# Altium schematic sheet JLINK V8_V1.SchDoc
size A3
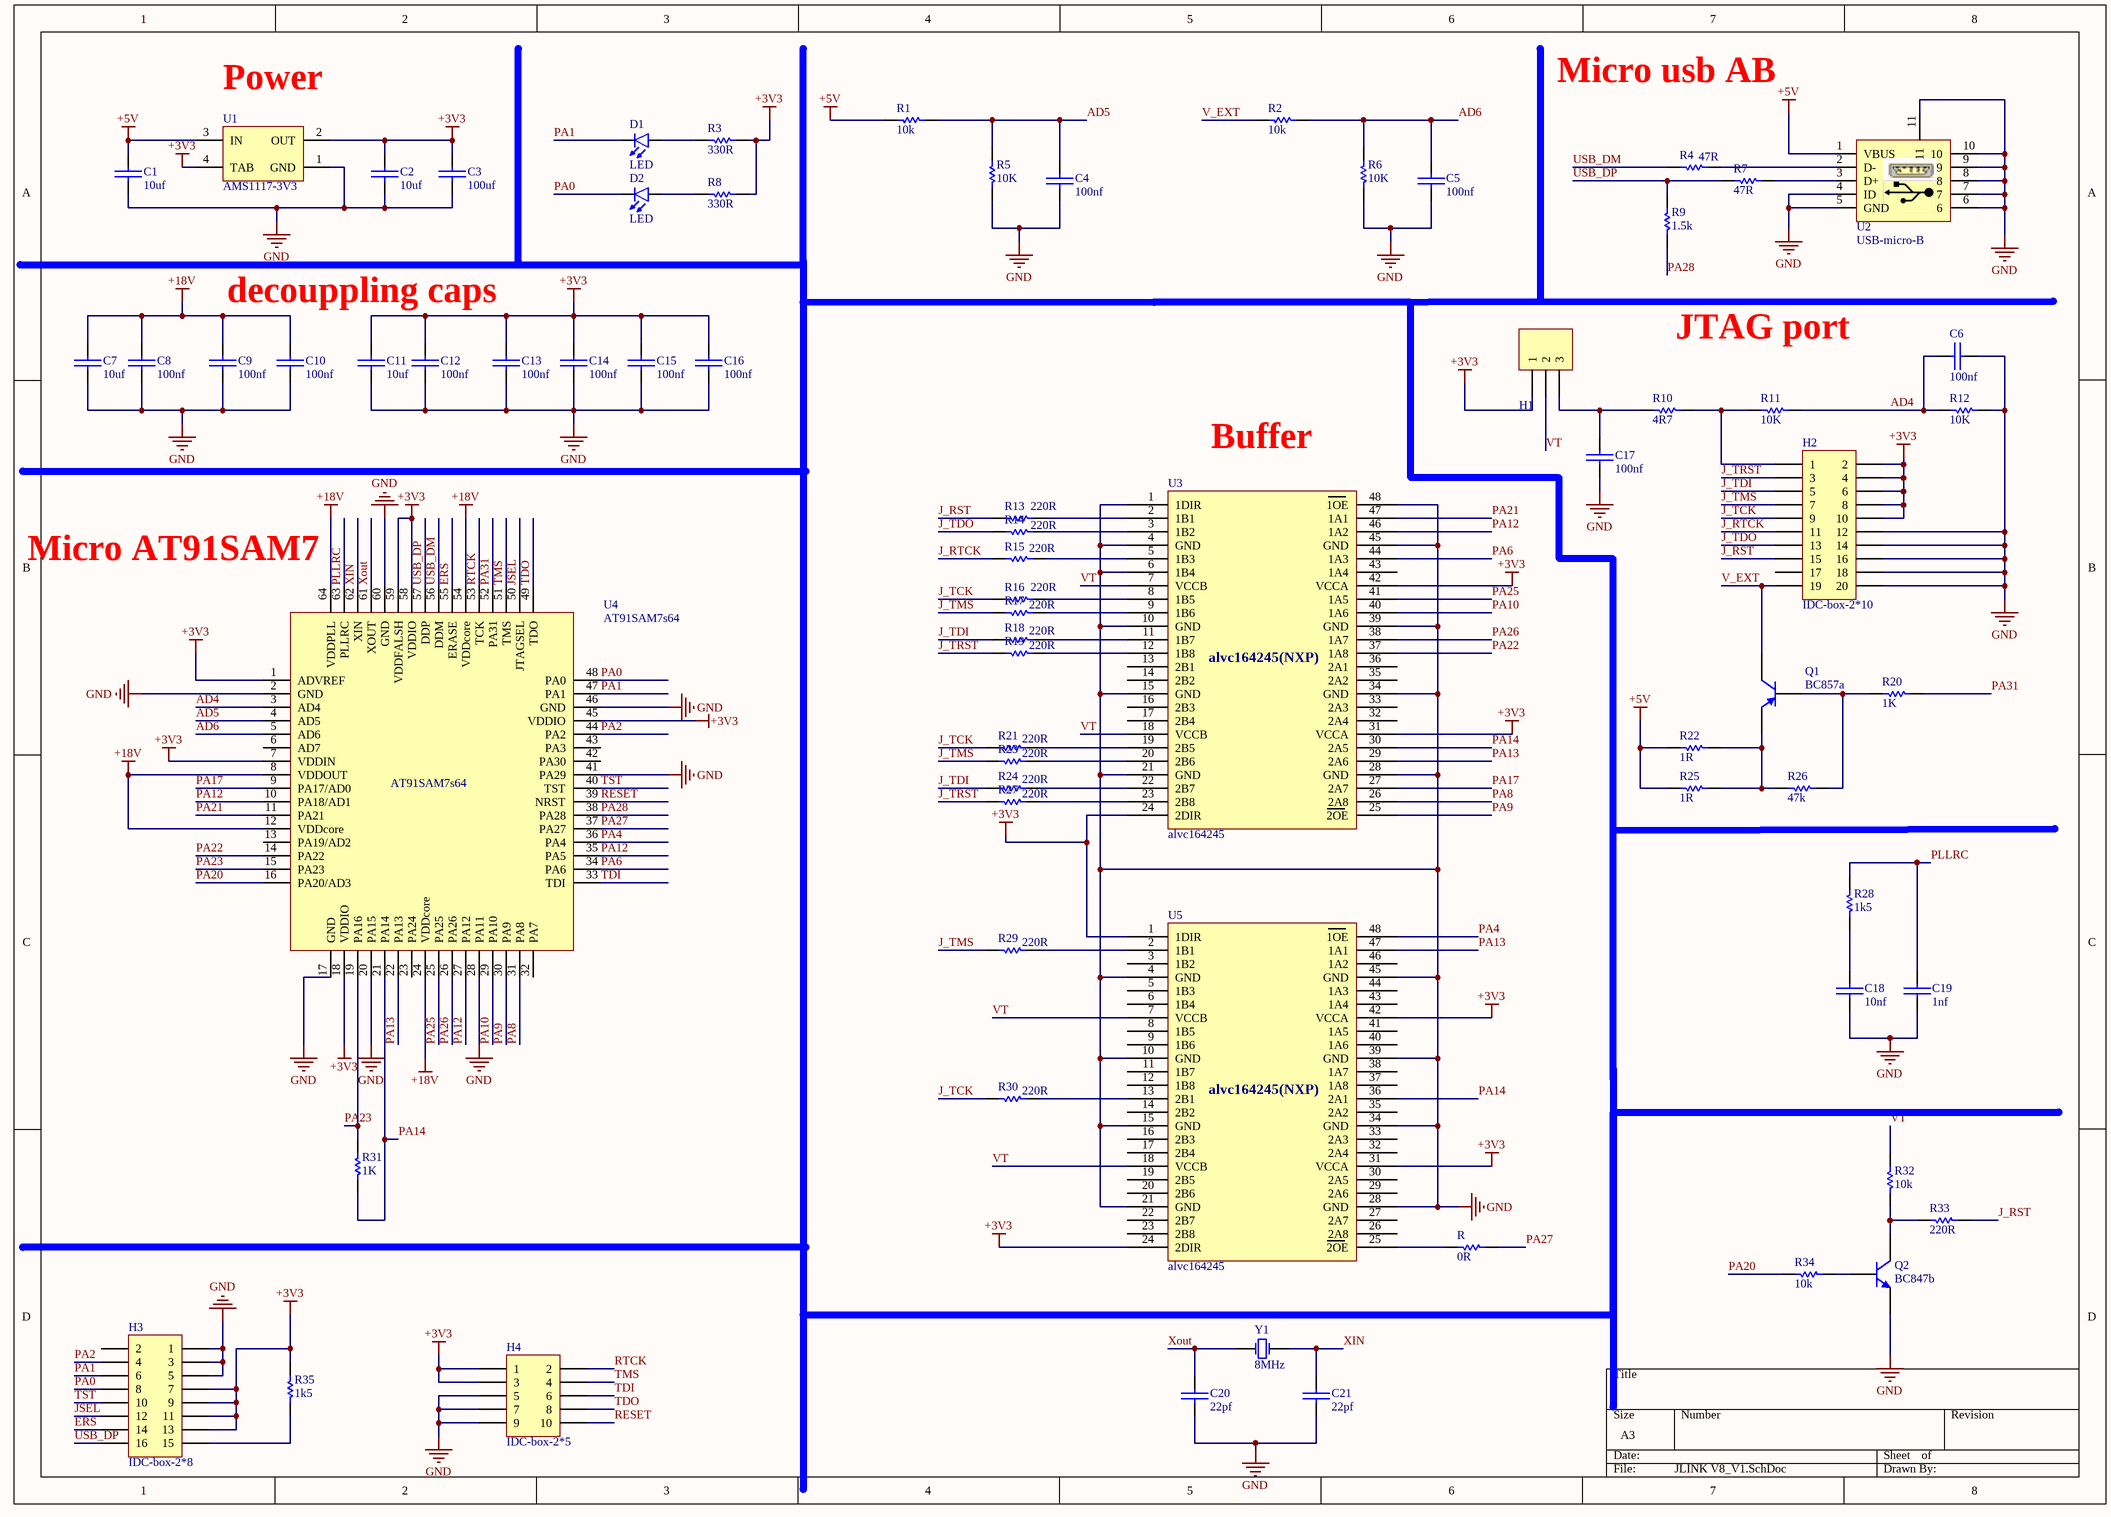
[diagram p0: JLINK V8_V1.SchDoc]

## Parts
C1  10uf  [CAP-0805 - better]
C2  10uf  [CAP-0805 - better]
C3  100uf  [CAP-0805 - better]
C4  100nf  [CAP-0805 - better]
C5  100nf  [CAP-0805 - better]
C6  100nf  [CAP-0805 - better]
C7  10uf  [CAP-0805 - better]
C8  100nf  [CAP-0805 - better]
C9  100nf  [CAP-0805 - better]
C10  100nf  [CAP-0805 - better]
C11  10uf  [CAP-0805 - better]
C12  100nf  [CAP-0805 - better]
C13  100nf  [CAP-0805 - better]
C14  100nf  [CAP-0805 - better]
C15  100nf  [CAP-0805 - better]
C16  100nf  [CAP-0805 - better]
C17  100nf  [CAP-0805 - better]
C18  10nf  [CAP-0805 - better]
C19  1nf  [CAP-0805 - better]
C20  22pf  [CAP-0805 - better]
C21  22pf  [CAP-0805 - better]
D1  LED  [LED-SMD-0805]
D2  LED  [LED-SMD-0805]
H1  Header 3  [PIN-header3(copy)]  (value not drawn)
H2  IDC-box-2*10  [ICD-box_10*2]
H3  IDC-box-2*8  [male-Header 2*8]
H4  IDC-box-2*5  [male-Header-2*5 - duplicate]
Q1  BC857a  [sot23]
Q2  BC847b  [sot23]
R  0R  [Res_SMD_0805]
R1  10k  [Res_SMD_0805]
R2  10k  [Res_SMD_0805]
R3  330R  [Res_SMD_0805]
R4  47R  [Res_SMD_0805]
R5  10K  [Res_SMD_0805]
R6  10K  [Res_SMD_0805]
R7  47R  [Res_SMD_0805]
R8  330R  [Res_SMD_0805]
R9  1.5k  [Res_SMD_0805]
R10  4R7  [Res_SMD_0805]
R11  10K  [Res_SMD_0805]
R12  10K  [Res_SMD_0805]
R13  220R  [Res_SMD_0805]
R14  220R  [Res_SMD_0805]
R15  220R  [Res_SMD_0805]
R16  220R  [Res_SMD_0805]
R17  220R  [Res_SMD_0805]
R18  220R  [Res_SMD_0805]
R19  220R  [Res_SMD_0805]
R20  1K  [Res_SMD_0805]
R21  220R  [Res_SMD_0805]
R22  1R  [Res_SMD_0805]
R23  220R  [Res_SMD_0805]
R24  220R  [Res_SMD_0805]
R25  1R  [Res_SMD_0805]
R26  47k  [Res_SMD_0805]
R27  220R  [Res_SMD_0805]
R28  1k5  [Res_SMD_0805]
R29  220R  [Res_SMD_0805]
R30  220R  [Res_SMD_0805]
R31  1K  [Res_SMD_0805]
R32  10k  [Res_SMD_0805]
R33  220R  [Res_SMD_0805]
R34  10k  [Res_SMD_0805]
R35  1k5  [Res_SMD_0805]
U1  AMS1117-3V3  [AMS1117-3V3]
U2  USB-micro-B  [USB-micro-b]
U3  alvc164245  [SSOP48]
U4  AT91SAM7s64  [LQFP-64]
U5  alvc164245  [SSOP48]
Y1  8MHz  [crystall]

## Nets
+3V3: C2.1(+) C3.1(+) C11.1(+) C12.1(+) C13.1(+) C14.1(+) C15.1(+) C16.1(+) H1.1 H2.2 H2.4 H2.6 H2.8 H2.10 H3.7 H3.9 H3.11 H3.13 H4.1 H4.3 R3.1 R8.1 R35.1 U1.2(OUT) U1.4(TAB) U3.24(2DIR) U3.31(VCCA) U3.42(VCCA) U4.1(ADVREF) U4.7(VDDIN) U4.18(VDDIO) U4.45(VDDIO) U4.58(VDDIO) U4.59(VDDFALSH) U5.1(1DIR) U5.24(2DIR) U5.31(VCCA) U5.42(VCCA)
+5V: C1.1(+) R1.2 R22.2 R25.2 U1.3(IN) U2.1(VBUS)
+18V: C7.1(+) C8.1(+) C9.1(+) C10.1(+) U4.8(VDDOUT) U4.12(VDDcore) U4.24(VDDcore) U4.54(VDDcore) U4.64(VDDPLL)
GND: C1.2(-) C2.2(-) C3.2(-) C4.2(-) C5.2(-) C6.2(-) C7.2(-) C8.2(-) C9.2(-) C10.2(-) C11.2(-) C12.2(-) C13.2(-) C14.2(-) C15.2(-) C16.2(-) C17.2(-) C18.2(-) C19.2(-) C20.2(-) C21.2(-) H2.12 H2.14 H2.16 H2.18 H2.20 H3.1 H3.3 H3.5 H4.5 H4.7 H4.9 Q2.2(E) R5.2 R6.2 R12.2 U1.1(GND) U2.4(ID) U2.5(GND) U2.6 U2.7 U2.8 U2.9 U2.10 U2.11 U3.1(1DIR) U3.4(GND) U3.6(1B4) U3.10(GND) U3.15(GND) U3.21(GND) U3.28(GND) U3.34(GND) U3.39(GND) U3.45(GND) U3.48(1OE) U4.2(GND) U4.17(GND) U4.20(PA15) U4.28(PA11) U4.41(PA29) U4.46(GND) U4.60(GND) U5.4(GND) U5.10(GND) U5.15(GND) U5.21(GND) U5.28(GND) U5.34(GND) U5.39(GND) U5.45(GND)
AD4: C6.1(+) R11.2 R12.1 U4.3(AD4)
AD5: C4.1(+) R1.1 R5.1 U4.4(AD5)
AD6: C5.1(+) R2.1 R6.1 U4.5(AD6)
ERS: H3.14 U4.55(ERASE)
J_RST: H2.15 R13.2 R33.1
J_RTCK: H2.11 R15.2
J_TCK: H2.9 R16.2 R21.2 R30.2
J_TDI: H2.5 R18.2 R24.2
J_TDO: H2.13 R14.2
J_TMS: H2.7 R17.2 R23.2 R29.2
J_TRST: H2.3 R19.2 R27.2
JSEL: H3.12 U4.50(JTAGSEL)
PA0: D2.2(K) H3.8 U4.48(PA0)
PA1: D1.2(K) H3.6 U4.47(PA1)
PA2: H3.4 U4.44(PA2)
PA4: U4.36(PA4) U5.48(1OE)
PA6: U3.44(1A3) U4.34(PA6)
PA8: U3.26(2A8) U4.31(PA8)
PA9: U3.25(2OE) U4.30(PA9)
PA10: U3.40(1A6) U4.29(PA10)
PA12: U3.46(1A2) U4.10(PA18/AD1) U4.27(PA12) U4.35(PA5)
PA13: U3.29(2A6) U4.22(PA13) U5.47(1A1)
PA14: R31.2 U3.30(2A5) U4.21(PA14) U5.36(2A1)
PA17: U3.27(2A7) U4.9(PA17/AD0)
PA20: R34.2 U4.16(PA20/AD3)
PA21: U3.47(1A1) U4.11(PA21)
PA22: U3.37(1A8) U4.14(PA22)
PA23: R31.1 U4.15(PA23) U4.19(PA16)
PA25: U3.41(1A5) U4.25(PA25)
PA26: U3.38(1A7) U4.26(PA26)
PA27: R.1 U4.37(PA27)
PA28: R9.2 U4.38(PA28)
PA31: R20.1 U4.52(PA31)
PLLRC: C19.1(+) R28.1 U4.63(PLLRC)
RESET: H4.10 U4.39(NRST)
RTCK: H4.2 U4.53(TCK)
TDI: H4.6 U4.33(TDI)
TDO: H4.8 U4.49(TDO)
TMS: H4.4 U4.51(TMS)
TST: H3.10 U4.40(TST)
USB_DM: R4.2 U4.56(DDM)
USB_DP: H3.16 R7.2 R9.1 U4.57(DDP)
V_EXT: H2.19 Q1.3(C) R2.2
VT: H1.2 R32.1 U3.7(VCCB) U3.18(VCCB) U5.7(VCCB) U5.18(VCCB)
XIN: C21.1(+) U4.62(XIN) Y1.1(OSC1)
Xout: C20.1(+) U4.61(XOUT) Y1.2(OSC2)
NetC17_1: C17.1(+) H1.3 R10.2
NetC18_1: C18.1(+) R28.2
NetD1_1: D1.1(A) R3.2
NetD2_1: D2.1(A) R8.2
NetH2_1: H2.1 R10.1 R11.1
NetH3_15: H3.15 R35.2
NetQ1_1: Q1.1(B) R20.2 R26.1
NetQ1_2: Q1.2(E) R22.1 R25.1 R26.2
NetQ2_1: Q2.1(B) R34.1
NetQ2_3: Q2.3(C) R32.2 R33.2
NetR4_1: R4.1 U2.2(D-)
NetR7_1: R7.1 U2.3(D+)
NetR13_1: R13.1 U3.2(1B1)
NetR14_1: R14.1 U3.3(1B2)
NetR15_1: R15.1 U3.5(1B3)
NetR16_1: R16.1 U3.8(1B5)
NetR17_1: R17.1 U3.9(1B6)
NetR18_1: R18.1 U3.11(1B7)
NetR19_1: R19.1 U3.12(1B8)
NetR21_1: R21.1 U3.19(2B5)
NetR23_1: R23.1 U3.20(2B6)
NetR24_1: R24.1 U3.22(2B7)
NetR27_1: R27.1 U3.23(2B8)
NetR29_1: R29.1 U5.2(1B1)
NetR30_1: R30.1 U5.13(2B1)
NetR_2: R.2 U5.25(2OE)

Not connected (* = marked no-connect by the designer): H2 17; H3 2; U3 13(2B1) 14(2B2) 16(2B3) 17(2B4) 32(2A4) 33(2A3) 35(2A2) 36(2A1) 43(1A4); U4 6(AD7) 13(PA19/AD2) 23(PA24) 32(PA7) 42(PA30) 43(PA3); U5 3(1B2) 5(1B3) 6(1B4) 8(1B5) 9(1B6) 11(1B7) 12(1B8) 14(2B2) 16(2B3) 17(2B4) 19(2B5) 20(2B6) 22(2B7) 23(2B8) 26(2A8) 27(2A7) 29(2A6) 30(2A5) 32(2A4) 33(2A3) 35(2A2) 37(1A8) 38(1A7) 40(1A6) 41(1A5) 43(1A4) 44(1A3) 46(1A2)

## Notes on the sheet
- (near U1) Power
- Micro usb AB
- decouppling caps
- JTAG port
- (near U3) Buffer
- (near U4) Micro AT91SAM7

## Library data of the parts
C1-C21 = CAP-0805
D1 D2 = LED-SMD-RED
H1 = Header 1*3: Header, 3-Pin; LatestRevisionDate: 17-Jul-2002; LatestRevisionNote: Re-released for DXP Platform.; Publisher: Altium Limited
H2 = Header 2*10
H3 = Header 2*8
H4 = Header 2*5: Header, 5-Pin, Dual row; LatestRevisionDate: 17-Jul-2002; LatestRevisionNote: Re-released for DXP Platform.; Publisher: Altium Limited
Q1 = PNP: PNP Bipolar Transistor; Published: 8-Jun-2000; LatestRevisionDate: 29-May-2009; LatestRevisionNote: IPC-7351 Footprint Added.; PackageVersion: Aug-1999; PackageReference: SOT-23B; Publisher: Altium Limited; PackageDescription: 3-Pin SOT-23 Package 0.95 mm Pitch, 2.4 mm Lead Span
Q2 = NPN: NPN Bipolar Transistor; Published: 8-Jun-2000; LatestRevisionDate: 29-May-2009; LatestRevisionNote: IPC-7351 Footprint Added.; PackageVersion: Aug-1999; PackageReference: SOT-23B; Publisher: Altium Limited; PackageDescription: 3-Pin SOT-23 Package 0.95 mm Pitch, 2.4 mm Lead Span
R R1-R19 R21-R30 R32-R35 = Res: Resistor; Value: 1K; Published: 8-Jun-2000; LatestRevisionDate: 17-Jul-2002; LatestRevisionNote: Re-released for DXP Platform.; PackageReference: AXIAL-0.3; Publisher: Altium Limited; PackageDescription: Axial Device, Thru-Hole; 2 Leads; 0.3 in Pin Spacing
R20 R31 = Res: Resistor; Published: 8-Jun-2000; LatestRevisionDate: 17-Jul-2002; LatestRevisionNote: Re-released for DXP Platform.; PackageReference: AXIAL-0.3; Publisher: Altium Limited; PackageDescription: Axial Device, Thru-Hole; 2 Leads; 0.3 in Pin Spacing; Value: 1K
U1 = AMS1117IMP-(SOT-223): x.x Volt, 800mA Low-Dropout Linear Regulator, 4-pin SOT-223; PartNumber: LM1117IMP-3.3; Manufacturer: National Semiconductor; PackageTopMarking: XYTT*N05B; PowerWise: N; CompType: LDO IC; Published: 4-Dec-2008; DatasheetVersion: Apr-2006; PackageVersion: revB, Apr-2003; PackageReference: MP04A; Publisher: Altium Limited; PackageDescription: Molded SOT-223, 6.50 x 3.56 x 1.6mm Body, 4 Lead, 2.3mm Pitch; Supplier 1: Farnell; Supplier Part Number 1: 7614123; RoHS: N; PinCount: 4; Code_JEDEC: TO-261-AA; Code_IPC: SOT223-4; ComponentLink1Description: LM1117 Datasheet; ComponentLink1URL: http://www.national.com/ds/LM/LM1117.pdf; ComponentLink2Description: LM1117 Web Page; ComponentLink2URL: http://www.national.com/pf/LM/LM1117.html; ComponentLink3Description: MP04A Package Page; ComponentLink3URL: http://www.national.com/packaging/folders/mp04a.html
U3 U5 = alvc164245(NXP)
U4 = AT91SAM7S64(LQFP)
Y1 = crystall: XTAL Crystal; Company: E.P.I.L; Design Date: 11/04/2011; Value: 8MHz